# Altium schematic sheet bhi260ap.SchDoc
size A4; SheetNumber: 6; SheetTotal: 7
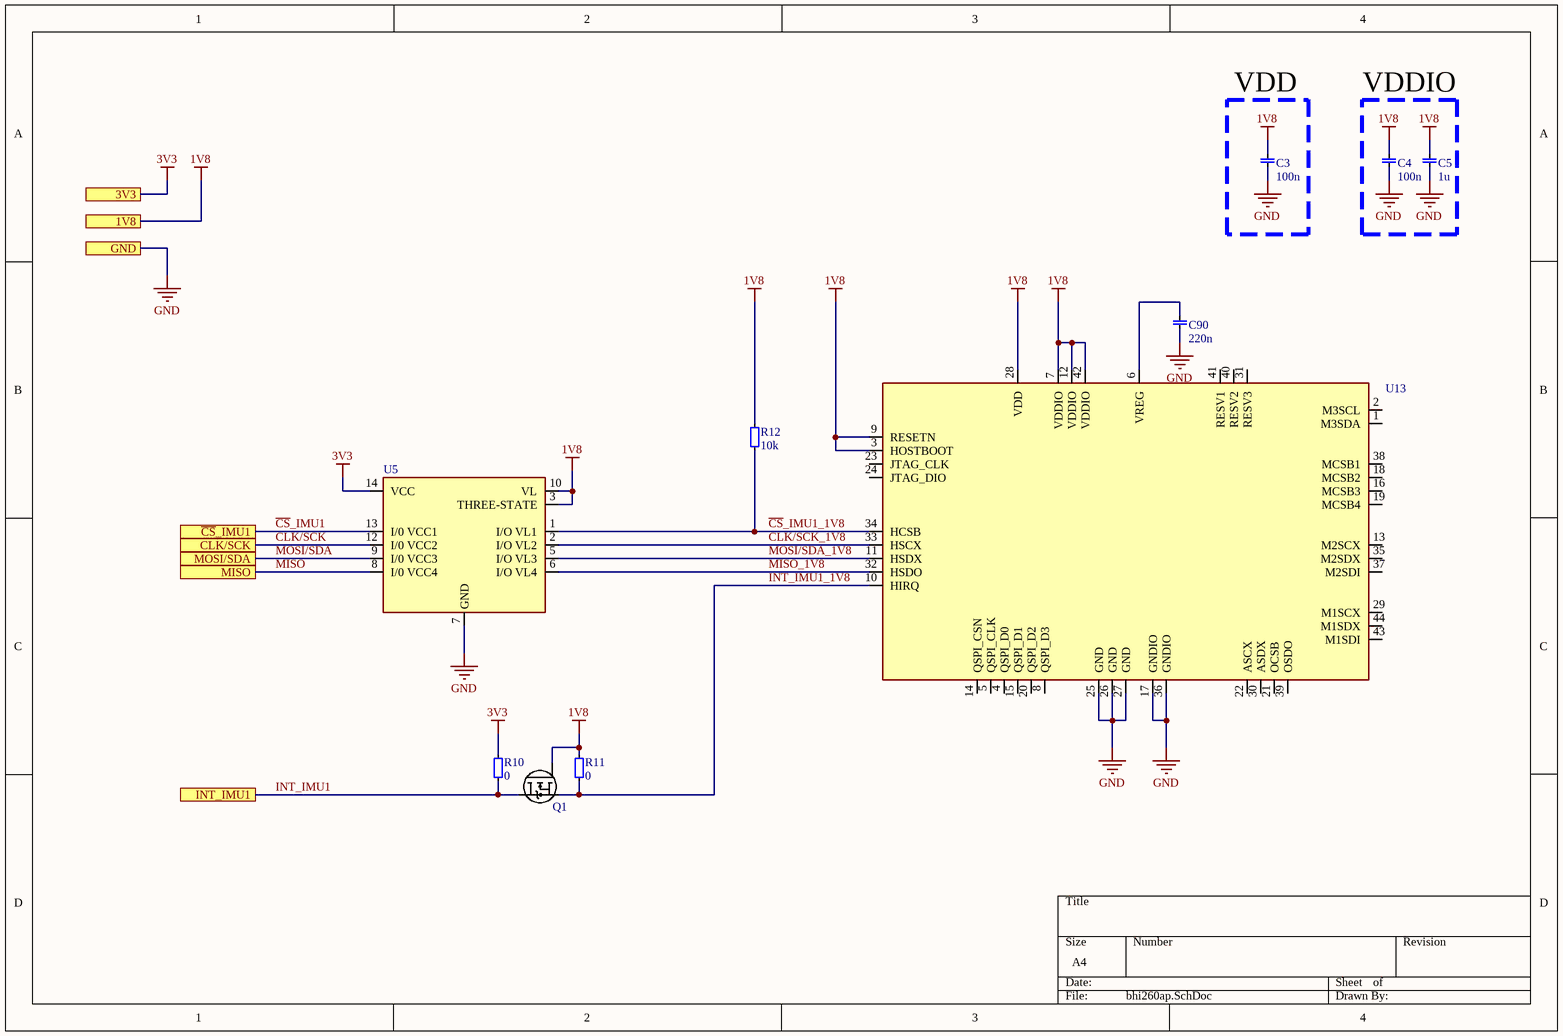
[diagram p0: bhi260ap.SchDoc]

## Parts
C3  value 100n  [0402 CAP]  (hidden comment: 0402 capacitor)
C4  value 100n  [0402 CAP]  (hidden comment: 0402 capacitor)
C5  value 1u  [0402 CAP]  (hidden comment: 0402 capacitor)
C90  value 220n  [0402 CAP]  (hidden comment: 0402 capacitor)
Q1  BSS138  [SOT323]  (value not drawn)
R10  value 0  [0402 res]  (hidden comment: 0603, resistor)
R11  value 0  [0402 res]  (hidden comment: 0603, resistor)
R12  value 10k  [0402 res]  (hidden comment: 0402, resistor)
U5  MAX3378E  [TDFN14]  (value not drawn)
U13  BHI260AP  [44-LGA]  (value not drawn)

## Blocks framed on the sheet
VDD: C3
VDDIO: C4 C5

## Ports
1V8, 3V3, CLK/SCK, GND, INT_IMU1, MISO, MOSI/SDA, ~{CS}_IMU1

## Nets
1V8: C3.1 C4.1 C5.1 Q1.1(G) R11.0 R12.0 U5.3(THREE-STATE) U5.10(VL) U13.3(HOSTBOOT) U13.7(VDDIO) U13.9(RESETN) U13.12(VDDIO) U13.28(VDD) U13.42(VDDIO) ; port 1V8
3V3: R10.0 U5.14(VCC) ; port 3V3
GND: C3.0 C4.0 C5.0 C90.0 U5.7(GND) U13.17(GNDIO) U13.25(GND) U13.26(GND) U13.27(GND) U13.36(GNDIO) ; port GND
~{CS}_IMU1: U5.13(I/0_VCC1) ; port ~{CS}_IMU1
~{CS}_IMU1_1V8: R12.1 U5.1(I/O_VL1) U13.34(HCSB)
CLK/SCK: U5.12(I/0_VCC2) ; port CLK/SCK
CLK/SCK_1V8: U5.2(I/O_VL2) U13.33(HSCX)
INT_IMU1: Q1.3(D) R10.1 ; port INT_IMU1
INT_IMU1_1V8: Q1.2(S) R11.1 U13.10(HIRQ)
MISO: U5.8(I/0_VCC4) ; port MISO
MISO_1V8: U5.6(I/O_VL4) U13.32(HSDO)
MOSI/SDA: U5.9(I/0_VCC3) ; port MOSI/SDA
MOSI/SDA_1V8: U5.5(I/O_VL3) U13.11(HSDX)
NetC90_1: C90.1 U13.6(VREG)

Not connected (* = marked no-connect by the designer): U13 1(M3SDA) 2(M3SCL) 4(QSPI_D0) 5(QSPI_CLK) 8(QSPI_D3) 13(M2SCX) 14(QSPI_CSN) 15(QSPI_D1) 16(MCSB3) 18(MCSB2) 19(MCSB4) 20(QSPI_D2) 21(OCSB) 22(ASCX) 23(JTAG_CLK) 24(JTAG_DIO) 29(M1SCX) 30(ASDX) 31(RESV3) 35(M2SDX) 37(M2SDI) 38(MCSB1) 39(OSDO) 40(RESV2) 41(RESV1) 43(M1SDI) 44(M1SDX)

## Library data of the parts
Q1 = BSS138: N-Channel Logic Level Enhancement Mode Field Effect Transistor
U5 = MAX3378E: 16 Mbps, Dual/Quad / Low-Voltage Level Translators
U13 = BHI260AP: Self-learning AI smart sensor with integrated IMU